# Altium project ZUM_Core.PrjPcb (part 2 of 2)

## Sheet Bluetooth.SchDoc: Bluetooth
size A4; Author: Andrés Gullón; DocumentNumber: 8; SheetNumber: 8; SheetTotal: 9
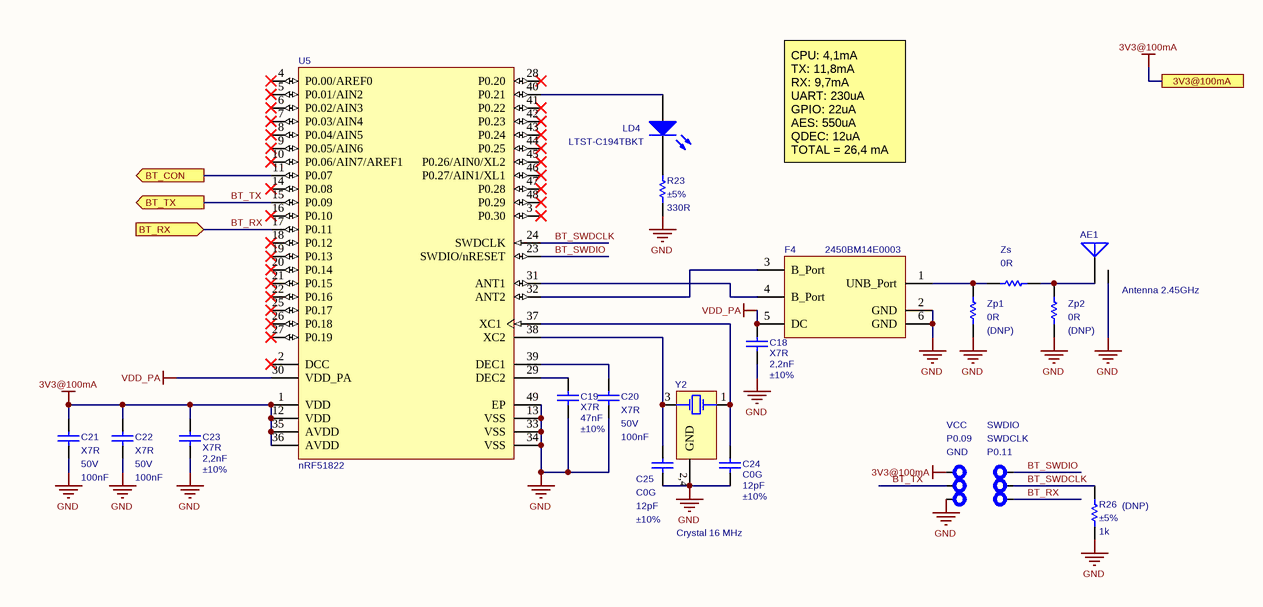
[diagram p8: Bluetooth.SchDoc]

### Parts
AE1  Antenna 2.45GHz  [MIFA_2.45GHz_7.2x11.1mm]  (no BOM)
C18  Dielectric: X7R  Capacitance: 2,2nF  Tolerance: ±10%  [C0402]  (hidden comment: C0402_2.2nF_16V_±10%)
C19  Dielectric: X7R  Capacitance: 47nF  Tolerance: ±10%  [C0402]  (hidden comment: C0402_47nF_16V_±10%)
C20  Dielectric: X7R  Voltage: 50V  Capacitance: 100nF  [C0603]  (hidden comment: C0603_100nF_50V_±10%_X7R)
C21  Dielectric: X7R  Voltage: 50V  Capacitance: 100nF  [C0603]  (hidden comment: C0603_100nF_50V_±10%_X7R)
C22  Dielectric: X7R  Voltage: 50V  Capacitance: 100nF  [C0603]  (hidden comment: C0603_100nF_50V_±10%_X7R)
C23  Dielectric: X7R  Capacitance: 2,2nF  Tolerance: ±10%  [C0402]  (hidden comment: C0402_2.2nF_16V_±10%)
C24  Dielectric: C0G  Capacitance: 12pF  Tolerance: ±10%  [C0402]  (hidden comment: C0402_12pF_16V_±10%)
C25  Dielectric: C0G  Capacitance: 12pF  Tolerance: ±10%  [C0402]  (hidden comment: C0402_12pF_16V_±10%)
F4  2450BM14E0003  [BAL-0603-6PIN]
GND  TP_POWER  [TP_POWER]  (value not drawn)  (no BOM)
LD4  LTST-C194TBKT  [LED0603]
P0.09  TP_POWER  [TP_POWER]  (value not drawn)  (no BOM)
P0.11  TP_POWER  [TP_POWER]  (value not drawn)  (no BOM)
R23  Tolerance: ±5%  Resistance: 330R  [R0402]  (hidden comment: R0402_330R_0.063W_±5%)
R26  Tolerance: ±5%  Resistance: 1k  Variant: (DNP)  [R0402]  (hidden comment: R0402_1k_0.063W_±5%)  (no BOM)
SWDCLK  TP_POWER  [TP_POWER]  (value not drawn)  (no BOM)
SWDIO  TP_POWER  [TP_POWER]  (value not drawn)  (no BOM)
U5  nRF51822  [QFN_48_6x6mm]
VCC  TP_POWER  [TP_POWER]  (value not drawn)  (no BOM)
Y2  Crystal 16 MHz  [ABM8G_3.2x2.5mm]
Zp1  Resistance: 0R  Variant: (DNP)  [R0402]  (hidden comment: R0402_0R_0.063W_±5%)  (no BOM)
Zp2  Resistance: 0R  Variant: (DNP)  [R0402]  (hidden comment: R0402_0R_0.063W_±5%)  (no BOM)
Zs  Resistance: 0R  [R0402]  (hidden comment: R0402_0R_0.063W_±5%)

### Ports
3V3@100mA, BT_CON (out), BT_RX (in), BT_TX (out)

### Nets
3V3@100mA: C21.2 C22.2 C23.2 U5.1(VDD) U5.12(VDD) U5.35(AVDD) U5.36(AVDD) VCC.1 ; port 3V3@100mA
GND: AE1.FEED_2 C18.1 C19.1 C20.1 C21.1 C22.1 C23.1 C24.2 C25.2 F4.2(GND) F4.6(GND) GND.1 R23.2 R26.1 U5.13(VSS) U5.33(VSS) U5.34(VSS) U5.49(EP) Y2.2(GND) Y2.4(GND) Zp1.1 Zp2.1
VDD_PA: C18.2 F4.5(DC) U5.30(VDD_PA)
BT_RX: P0.11.1 U5.17(P0.11) ; port BT_RX
BT_SWDCLK: R26.2 SWDCLK.1 U5.24(SWDCLK)
BT_SWDIO: SWDIO.1 U5.23(SWDIO/nRESET)
BT_TX: P0.09.1 U5.15(P0.09) ; port BT_TX
NetAE1_FEED_1: AE1.FEED_1 Zp2.2 Zs.2
NetC19_2: C19.2 U5.29(DEC2)
NetC20_2: C20.2 U5.39(DEC1)
NetC24_1: C24.1 U5.37(XC1) Y2.1(OSC1)
NetC25_1: C25.1 U5.38(XC2) Y2.3(OSC2)
NetF4_1: F4.1(UNB_Port) Zp1.2 Zs.1
NetF4_3: F4.3(B_Port) U5.32(ANT2)
NetF4_4: F4.4(B_Port) U5.31(ANT1)
NetLD4_A: LD4.A U5.40(P0.21)
NetLD4_K: LD4.K R23.1
NetR22_1: U5.11(P0.07) ; port BT_CON

Not connected (* = marked no-connect by the designer): U5 2(DCC)* 3(P0.30)* 4(P0.00/AREF0)* 5(P0.01/AIN2)* 6(P0.02/AIN3)* 7(P0.03/AIN4)* 8(P0.04/AIN5)* 9(P0.05/AIN6)* 10(P0.06/AIN7/AREF1)* 14(P0.08)* 16(P0.10)* 18(P0.12)* 19(P0.13)* 20(P0.14)* 21(P0.15)* 22(P0.16)* 25(P0.17)* 26(P0.18)* 27(P0.19)* 28(P0.20)* 41(P0.22)* 42(P0.23)* 43(P0.24)* 44(P0.25)* 45(P0.26/AIN0/XL2)* 46(P0.27/AIN1/XL1)* 47(P0.28)* 48(P0.29)*

### Notes on the sheet
- CPU: 4,1mA
  TX: 11,8mA
  RX: 9,7mA
  UART: 230uA
  GPIO: 22uA
  AES: 550uA
  QDEC: 12uA
  TOTAL = 26,4 mA
  GPIO: 3,3V
- Title
- Project
- Size:
- Author
- A4
- Number:
- Revision:
- Mundo Reader, S.L. This project and all the sheets and layouts enclosed are licensed under Creative Commons by Attribution and Share Alike [CC BY-SA] (www.creativecommons.com)
- Date:
- Time:
- Sheet
- of
- (in symbol CMP-A2261-2) 2,4

### Library data of the parts
AE1 = CMP-00336-2: MIFA Antenna 2.45GHz; Description ES: Antena MIFA 2.45GHz
C18 C23 = CMP-A0549-2: Manufacturer: Kemet; Value: 2,2nF ±10% 16V; Voltage: 16V; OrderingCode: C0402C222K4RAC; Temp_ Max: 125; Temp_ Min: -55; AccessRights: 2147483647; ContentType: Component; Description ES: Condensador; Folder: Components Library\Pasives\Capacitor_SMD\C0402_16V$\; RevisionId: 1; SchLibComponentName: Capacitor; Part Number: C0402_2.2nF_16V_±10%; Price units: EUR; ComponentType: Capacitor; ContentTypeGUID: CB3C11C4-E317-11DF-B822-12313F0024A2; FolderGUID: B1BE7916-43F7-4918-A273-F24409A7170B; ItemGUID: 471CAD91-A991-4965-8D31-154961728350; ItemHRID: CMP-A0549; LifeCycle: New From Design; LifeCycleStateGUID: 706004B5-C76E-482E-903B-BA0E4FAE086A; ReleaseDate: 19/02/2016 10:20:28 AM
C19 = CMP-A0571-2: Manufacturer: Kemet; Value: 47nF ±10% 16V; Voltage: 16V; OrderingCode: C0402C473K4RAC; Temp_ Max: 125; Temp_ Min: -55; AccessRights: 2147483647; ContentType: Component; Description ES: Condensador; Folder: Components Library\Pasives\Capacitor_SMD\C0402_16V$\; RevisionId: 1; SchLibComponentName: Capacitor; Part Number: C0402_47nF_16V_±10%; Price units: EUR; ComponentType: Capacitor; ContentTypeGUID: CB3C11C4-E317-11DF-B822-12313F0024A2; FolderGUID: B1BE7916-43F7-4918-A273-F24409A7170B; ItemGUID: F44DF0E5-D5E0-4AC7-88A3-40CD5FCE7144; ItemHRID: CMP-A0571; LifeCycle: For Prototype; LifeCycleStateGUID: 175FAE11-0700-4285-B1EB-BBB8F0F6EEBE; ReleaseDate: 22/05/2017 04:17:24 PM
C20-C22 = CMP-00257-1: Manufacturer: Kemet; Description ES: Condensador; OrderingCode: C0603C104K5RAC; OrderingCode 2: 06035C104KAT2A; SchLibComponentName: Capacitor; Temp_ Max: 125; Temp_ Min: -55; Tolerance: ±10%; Value: 100nF ±10% 50V; Manufacturer 2: AVX; Part Number: C0603_100nF_50V_±10%_X7R; Price units: EUR
C24 C25 = CMP-A0540-2: Manufacturer: Kemet; Value: 12pF ±10% 16V; Voltage: 16V; OrderingCode: C0402C120K4GAC; Temp_ Max: 125; Temp_ Min: -55; AccessRights: 2147483647; ContentType: Component; Description ES: Condensador; Folder: Components Library\Pasives\Capacitor_SMD\C0402_16V$\; RevisionId: 1; SchLibComponentName: Capacitor; Part Number: C0402_12pF_16V_±10%; Price units: EUR; ComponentType: Capacitor; ContentTypeGUID: CB3C11C4-E317-11DF-B822-12313F0024A2; FolderGUID: B1BE7916-43F7-4918-A273-F24409A7170B; ItemGUID: BB1D80C7-7E3B-4A42-A51A-EC98606060E4; ItemHRID: CMP-A0540; LifeCycle: New From Design; LifeCycleStateGUID: 706004B5-C76E-482E-903B-BA0E4FAE086A; ReleaseDate: 19/02/2016 10:19:26 AM
F4 = CMP-00293-2: 2.45GHz Impedance Matched Balun + Band Pass Filter; Manufacturer: Johanson; Description ES: 2.45GHz Adaptación de impedancia y filtro pasa banda; Temp_ Max: 105; Temp_ Min: -40; Value: Balun 2.45GHz; OrderingCode: 2450BM14E0003; Part Number: 2450BM14E0003
GND P0.09 P0.11 SWDCLK SWDIO VCC = CMP-A2499-3: Testpoint 0.3mm; Manufacturer: Oxley; OrderingCode: SMOX/060/B1; SAP: 303552; SchLibComponentName: Testpoint; Part Number: TP_POWER; Price units: EUR
LD4 = CMP-A2557-1: LED; Manufacturer: Lite-On; Temp_ Max: 80; Temp_ Min: -20; OrderingCode 2: HSMN-C120; Value: Blue; SchLibComponentName: LED; Part Number: LTST-C194TBKT; OrderingCode: LTST-C194TBKT; Description ES: LED; Price units: EUR; Manufacturer 2: Avago Technologies
R23 = CMP-A1762-2: Manufacturer: Vishay; SchLibComponentName: Resistor; OrderingCode: CRCW0402330RJN; Power: 0.063W; Value: 330R ±5% 0.063W; Temp_ Max: 155; Temp_ Min: -55; Description ES: Resistencia; PackageDescription: SMD; Part Number: R0402_330R_0.063W_±5%; Price units: EUR
R26 = CMP-A1718-3: Manufacturer: Vishay; SchLibComponentName: Resistor; OrderingCode: CRCW04021K00JN; Power: 0.063W; Value: 1k ±5% 0.063W; Temp_ Max: 155; Temp_ Min: -55; Description ES: Resistencia; PackageDescription: SMD; Part Number: R0402_1k_0.063W_±5%; Price units: EUR
U5 = CMP-00292-1: Multiprotocol Bluetooth® low energy/2.4 GHz RF System on Chip; Manufacturer: Nordic; Description ES: Bluetooth low energy SoC; OrderingCode: NRF51822-QFAB-T; Temp_ Max: 75; Temp_ Min: -25; Value: BLE; Part Number: nRF51822; Price units: €
Y2 = CMP-A2261-2: Part Number: ABM8G 16MHz; Manufacturer: Abracon; RevisionId: 1; AccessRights: 2147483647; Folder: Components Library\Frequency\Cristales$\; ContentType: Component; Tolerance: ±30ppm; Load Capacitance: 10pF; OrderingCode: ABM8G-16.000MHZ-B4Y-T; Description ES: Cristal 16 MHz; Temp_Max: 70; Temp_Min: -20; Value: 16MHz; OrderingCode 2: 7V-16.000MAHQ-T; OrderingCode 3: 403C35A16M00000; LifeCycleStateGUID: 706004B5-C76E-482E-903B-BA0E4FAE086A; ReleaseDate: 24/02/2016 11:38:51 AM; ContentTypeGUID: CB3C11C4-E317-11DF-B822-12313F0024A2; ItemGUID: 988C2C72-01AC-4FA2-9690-D37CC5024304; ItemHRID: CMP-A2261; FolderGUID: AC2325A2-8D03-4A7D-BE26-CA1CD14B1620; LifeCycle: New From Design; SchLibComponentName: Crystal 4 pin; Price units: EUR; Manufacturer 2: TXC; Manufacturer 3: CTS
Zp1 Zp2 Zs = CMP-A1689-4: Manufacturer: Panasonic; OrderingCode: ERJ-2GE0R00X; Power: 0.063W; Value: 0R ±5% 0.063W; OrderingCode 2: RC0402FR-070RL; Description ES: Resistencia; OrderingCode 3: CRCW04020000Z0; SchLibComponentName: Resistor; Tolerance: ±5%; Temp_ Max: 155; Temp_ Min: -55; Part Number: R0402_0R_0.063W_±5%; Price units: EUR; Manufacturer 2: Yageo; Manufacturer 3: Vishay; PackageDescription: SMD

## Nets that join several sheets
3V3@100mA: ZUM_Core (J11.4), USB_CP2104 (C6.2 U2.5 U2.6), Bluetooth (8 pins)
5V@3A: ZUM_Core_Power (Q1.2 Q2.2), MP1477H_DCDC_5V (6 pins)
5V@300mA: ZUM_Core_Power (Q3.2 Q4.2 R14.1), MP2019_LDO_5V (7 pins)
+5V_USB: USB_CP2104 (C8.2 L1.2 U2.8), ZUM_Core_Power (Q1.3 Q4.3)
GND: ZUM_Core (27 pins), ATMega328 (8 pins), USB_CP2104 (13 pins), ZUM_Core_Power (5 pins), MP1477H_DCDC_5V (6 pins), MP2019_LDO_5V (7 pins), ZUM_Core_USB_BT (6 pins), ZUM_Core_Autoreset (D1.1 R19.2 SW1.1), Bluetooth (22 pins)
PWR_DCDC: ZUM_Core (23 pins), ZUM_Core_Power (Q2.3 TP6.1)
PWR_LDO: ZUM_Core (J10.2 J11.2), ATMega328 (6 pins), USB_CP2104 (5 pins), ZUM_Core_Power (D3.A Q3.3 TP7.1), ZUM_Core_USB_BT (C17.2 U4.16), ZUM_Core_Autoreset (D1.2 R10.1)
VDC: ZUM_Core (J11.8), ZUM_Core_Power (5 pins)
Vin_DCDC: ZUM_Core_Power (D6.k), MP1477H_DCDC_5V (C16.2 C26.2 R6.2 U3.1)
A0: ZUM_Core (J9.1 J12.1), ATMega328 (U1.23)
A1: ZUM_Core (J9.2 J12.2), ATMega328 (U1.24)
A2: ZUM_Core (J9.3 J12.3), ATMega328 (U1.25)
A3: ZUM_Core (J9.4 J12.4), ATMega328 (U1.26)
A4: ZUM_Core (J9.5 J12.5 J15.9), ATMega328 (U1.27)
A5: ZUM_Core (J9.6 J12.6 J15.10), ATMega328 (U1.28)
AREF: ZUM_Core (J15.8), ATMega328 (C5.2 U1.20)
BT_RX: ZUM_Core_USB_BT (U4.3), Bluetooth (P0.11.1 U5.17)
BT_TX: ZUM_Core_USB_BT (U4.6), Bluetooth (P0.09.1 U5.15)
D0: ZUM_Core (J5.1 J6.8), ATMega328 (U1.30), ZUM_Core_USB_BT (U4.7)
D1: ZUM_Core (J5.2 J6.7), ATMega328 (U1.31), ZUM_Core_USB_BT (U4.4)
D2: ZUM_Core (J5.3 J6.6), ATMega328 (U1.32)
D3: ZUM_Core (J5.4 J6.5), ATMega328 (U1.1)
D4: ZUM_Core (J5.5 J6.4), ATMega328 (U1.2)
D5: ZUM_Core (J5.6 J6.3), ATMega328 (U1.9)
D6: ZUM_Core (J5.7 J6.2), ATMega328 (U1.10)
D7: ZUM_Core (J5.8 J6.1), ATMega328 (U1.11)
D8: ZUM_Core (J2.8 J15.1), ATMega328 (U1.12)
D9: ZUM_Core (J2.7 J15.2), ATMega328 (U1.13)
D10: ZUM_Core (J2.6 J15.3), ATMega328 (U1.14)
D11: ZUM_Core (J2.5 J10.4 J15.4), ATMega328 (U1.15)
D12: ZUM_Core (J2.4 J10.1 J15.5), ATMega328 (U1.16)
D13: ZUM_Core (D4.A J2.3 J10.3 J15.6), ATMega328 (U1.17)
D22: ZUM_Core (J2.2), ATMega328 (U1.3)
D23: ZUM_Core (J2.1), ATMega328 (U1.6)
~{MCU_RES}: ZUM_Core (J10.5 J11.3), ATMega328 (U1.29), ZUM_Core_Autoreset (5 pins)
NetC31_1: ZUM_Core_Power (D2.k), MP2019_LDO_5V (C31.1 U6.4 U6.5)
NetR22_1: ZUM_Core_USB_BT (R22.1 TP5.1 U4.1), Bluetooth (U5.11)
USB_~{DTR}: USB_CP2104 (U2.23), ZUM_Core_USB_BT (U4.11)
USB_Reset: ZUM_Core_USB_BT (U4.9), ZUM_Core_Autoreset (R20.2)
USB_RX: USB_CP2104 (U2.20 USB_RX.1), ZUM_Core_USB_BT (U4.2)
USB_TX: USB_CP2104 (U2.21 USB_TX.1), ZUM_Core_USB_BT (U4.5)

## Assembly variants
ZUM_Core_2.0: not fitted C29 C34 Zp1 Zp2